# Altium schematic sheet GTR.schdoc
size A4; CompanyName: Technische Hochschule Nürnberg Georg Simon Ohm; Organization: UltraZohm; Address1: Kesslerplatz 12; Address2: 90489 Nürnberg; Address3: GERMANY; SheetNumber: 34; SheetTotal: 36; Website: www.ultrazohm.com
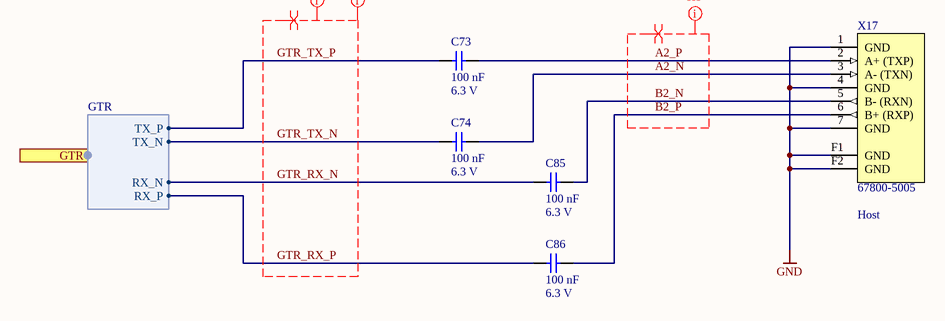
[diagram p0: GTR.schdoc]

## Parts
C73  100 nF  Voltage: 6.3 V  [C_0201_TE]
C74  100 nF  Voltage: 6.3 V  [C_0201_TE]
C85  100 nF  Voltage: 6.3 V  [C_0201_TE]
C86  100 nF  Voltage: 6.3 V  [C_0201_TE]
X17  67800-5005  [67800-5005]

## Ports
GTR (harness GTR)

## Harnesses
GTR: RX_N, RX_P, TX_N, TX_P

## Nets
GND: X17.1(GND) X17.4(GND) X17.7(GND) X17.F1(GND) X17.F2(GND)
A2_N: C74.2 X17.3(A-_(TXN))
A2_P: C73.2 X17.2(A+_(TXP))
B2_N: C85.2 X17.5(B-_(RXN))
B2_P: C86.2 X17.6(B+_(RXP))
GTR_RX_N: C85.1 ; port GTR.RX_N
GTR_RX_P: C86.1 ; port GTR.RX_P
GTR_TX_N: C74.1 ; port GTR.TX_N
GTR_TX_P: C73.1 ; port GTR.TX_P

## Layout directives
differential pair: A2_N, A2_P, B2_N, B2_P, GTR_RX_N, GTR_RX_P, GTR_TX_N, GTR_TX_P
net class HS: A2_N, A2_P, B2_N, B2_P, GTR_RX_N, GTR_RX_P, GTR_TX_N, GTR_TX_P
net class SATA: GTR_RX_N, GTR_RX_P, GTR_TX_N, GTR_TX_P

## Notes on the sheet
- (near X17) Host
- Title
- Revision:
- Design Engineer:
- Date:
- Project:
- Sheet
- of

## Library data of the parts
C73 C74 C85 C86 = UZgen_C_0201_100nF_6.3V_X7R: Generic capacitor; Manufacturer: UZgen; Tolerance: 10 %; Created from: MGeier; Technology: X7R; Value: 100 nF; Manufacturer Part Number: UZgen_C_0201_100nF_6.3V_X7R; PartID: 5221; Created On: 02/08/2024 14:41:26; Device Package: 0201; Mounting Type: SMD; Last Updated: 02/08/2024 14:45:57
X17 = 67800-5005: SATA Connector - I/O Connectors 7Ckt Vert Signal Hdr SMT w/ locking latch; Manufacturer: Molex; AN: 25614; Created from: MGremer; Number of positions: 7; Mixed: SMT; HelpURL: B:\AD\adlib\datasheet\67800-5005; H-ART: 67800-5005; Manufacturer Part Number: 67800-5005; PartID: 43; Created On: 30.03.2021 07:43:17; ComponentLink1Description: Datasheet; ComponentLink1URL: https://www.mouser.de/datasheet/2/276/1/0678005005_PCB_HEADERS-172127.pdf; Component Type: SATA Connector; Device Package: SATA Connector; Last Updated: 30.03.2021 07:43:17; Mounting Type: SMD; Operating Temperature: -35 - 85 °C; Series: 67800; Supplier 1: Mouser; Supplier Part Number 1: 538-67800-5005; Type: SATA Connector; Live Cycle Status: 1; Number of rows: 2; Stock number: not stored